# Altium schematic sheet Motor_Driver_Sheet3.SchDoc
size 420 x 297 mm; SheetNumber: 23; SheetTotal: 32
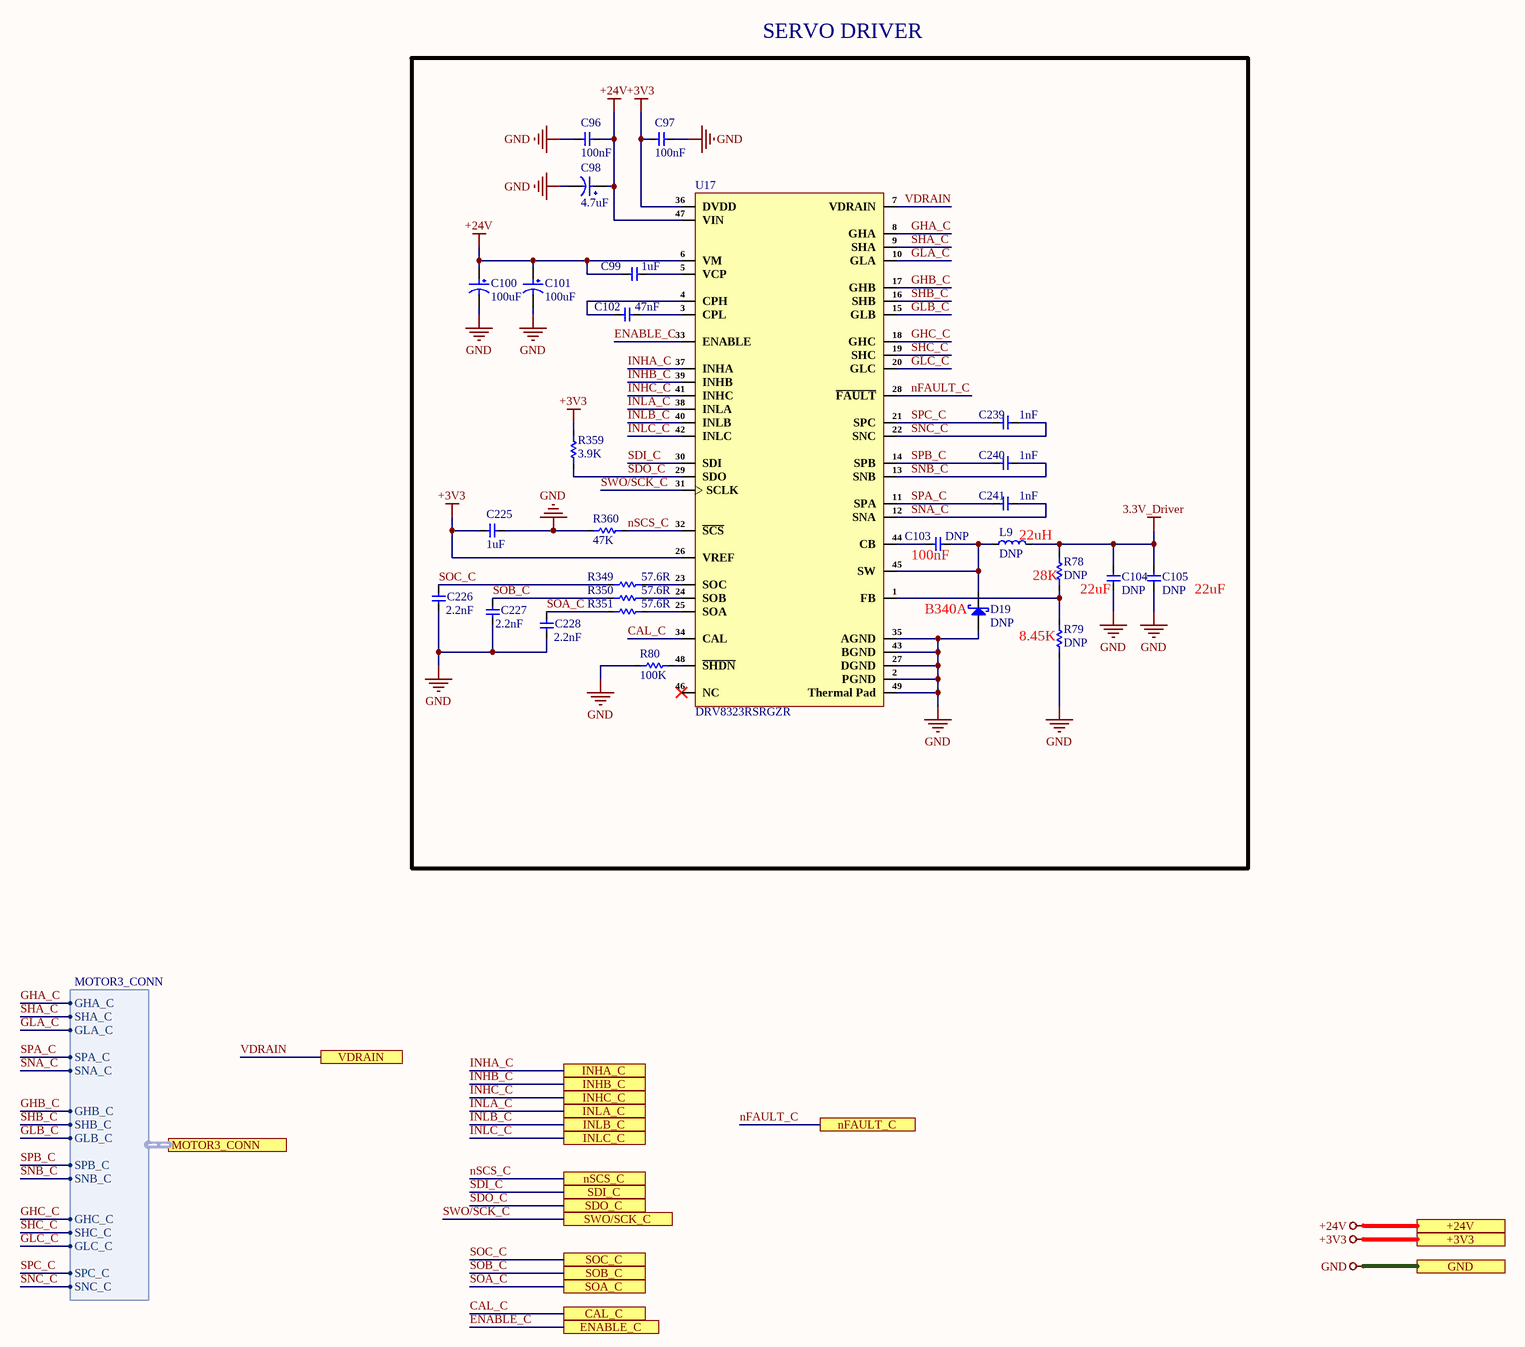
[diagram p0: Motor_Driver_Sheet3.SchDoc]

## Parts
C96  100nF  [cap-0402]
C97  100nF  [cap-0402]
C98  4.7uF  [VT1H4R7M0405]
C99  1uF  [Cap-0402]
C100  100uF  [RVT1A101M0605]
C101  100uF  [RVT1A101M0605]
C102  47nF  [Cap-0402]
C103  DNP  [cap-0402]
C104  DNP  [Cap-0805]
C105  DNP  [Cap-0805]
C225  1uF  [Cap-0402]
C226  2.2nF  [Cap-0603]
C227  2.2nF  [Cap-0603]
C228  2.2nF  [Cap-0603]
C239  1nF  [Cap-0402]
C240  1nF  [Cap-0402]
C241  1nF  [Cap-0402]
D19  DNP  [SMA(DO-214AC)]
L9  DNP  [SLF7045T- 220MR90-PF]
R78  DNP  [Res-0402]
R79  DNP  [Res-0402]
R80  100K  [Res-0402]
R349  57.6R  [Res-0402]
R350  57.6R  [Res-0402]
R351  57.6R  [Res-0402]
R359  3.9K  [Res-0402]
R360  47K  [Res-0402]
U17  DRV8323RSRGZR  [48-VQFN (7x7)]

## Ports
+3V3 (see Servo3[3A], CAN_Sheet[5D], Connector_Sheet[5D], Controller_Sheet[5D], Encoder_Sheet1[5D], Encoder_Sheet2[5D], Encoder_Sheet3[5D], Encoder_Sheet4[5D], EtherCAT_Sheet[5D], Motor_Driver_Sheet1[5D], Motor_Driver_Sheet2[5D], Motor_Driver_Sheet4[5D], Power_Sheet[5D], RJ45_Sheet[5D], RS485_RS232_Sheet[3D], Sec_Controller_Sheet1[5D], Sec_Controller_Sheet2[5D], Sec_Controller_Sheet3[5D], Sec_Controller_Sheet4[5D]), +24V (see Servo3[3A], Connector_Sheet[5D], DIO_1[5D], DIO_2[5D], DIO_3[5D], DIO_4[5D], MOSFET_Driver_Sheet1[5D], MOSFET_Driver_Sheet2[5D], MOSFET_Driver_Sheet3[5D], MOSFET_Driver_Sheet4[5D], Motor_Driver_Sheet1[5D], Motor_Driver_Sheet2[5D], Motor_Driver_Sheet4[5D], Power_Sheet[5D]), CAL_C (see Servo3[3B], Sec_Controller_Sheet3[2D]), ENABLE_C (see Servo3[3B], Sec_Controller_Sheet3[2D]), GND (see Servo3[3B], CAN_Sheet[5D], Connector_Sheet[5D], Controller_Sheet[5D], DIO_1[5D], DIO_2[5D], DIO_3[5D], DIO_4[5D], Encoder_Sheet1[5D], Encoder_Sheet2[5D], Encoder_Sheet3[5D], Encoder_Sheet4[5D], EtherCAT_Sheet[5D], MOSFET_Driver_Sheet1[5D], MOSFET_Driver_Sheet2[5D], MOSFET_Driver_Sheet3[5D], MOSFET_Driver_Sheet4[5D], Motor_Driver_Sheet1[5D], Motor_Driver_Sheet2[5D], Motor_Driver_Sheet4[5D], Power_Sheet[5D], RJ45_Sheet[5D], RS485_RS232_Sheet[3D], Sec_Controller_Sheet1[5D], Sec_Controller_Sheet2[5D], Sec_Controller_Sheet3[5D], Sec_Controller_Sheet4[5D]), INHA_C (see Servo3[3B], Sec_Controller_Sheet3[2D]), INHB_C (see Servo3[3B], Sec_Controller_Sheet3[2D]), INHC_C (see Servo3[3B], Sec_Controller_Sheet3[2D]), INLA_C (see Servo3[3B], Sec_Controller_Sheet3[2D]), INLB_C (see Servo3[3B], Sec_Controller_Sheet3[2D]), INLC_C (see Servo3[3B], Sec_Controller_Sheet3[2D]), MOTOR3_CONN (harness MOTOR3_CONN, see Servo3[4B], MOSFET_Driver_Sheet3[2D]), nFAULT_C (see Servo3[3B], Sec_Controller_Sheet3[3D]), nSCS_C (see Servo3[3B], Sec_Controller_Sheet3[2D]), SDI_C (see Servo3[3B], Sec_Controller_Sheet3[2D]), SDO_C (see Servo3[3B], Sec_Controller_Sheet3[2D]), SOA_C (see Servo3[3B], Sec_Controller_Sheet3[2D]), SOB_C (see Servo3[3B], Sec_Controller_Sheet3[2D]), SOC_C (see Servo3[3B], Sec_Controller_Sheet3[2D]), SWO/SCK_C (see Servo3[3B], Sec_Controller_Sheet3[2D]), VDRAIN (see Servo3[4B], MOSFET_Driver_Sheet1[2D], MOSFET_Driver_Sheet2[2D], MOSFET_Driver_Sheet3[2D], MOSFET_Driver_Sheet4[2D], Motor_Driver_Sheet1[2D], Motor_Driver_Sheet2[2D], Motor_Driver_Sheet4[2D])

## Harnesses
MOTOR3_CONN: GHA_C, SHA_C, GLA_C, SPA_C, SNA_C, GHB_C, SHB_C, GLB_C, SPB_C, SNB_C, GHC_C, SHC_C, GLC_C, SPC_C, SNC_C

## Nets
3.3V_Driver: C104.2 C105.2 L9.2 R78.2
+3V3: C97.2 C225.1 R359.2 U17.26(VREF) U17.36(DVDD) ; port +3V3
+24V: C96.1 C98.1 C99.2 C100.1 C101.1 U17.6(VM) U17.47(VIN) ; port +24V
GND: C96.2 C97.1 C98.2 C100.2 C101.2 C104.1 C105.1 C225.2 C226.1 C227.1 C228.1 D19.2(A) R79.1 R80.1 R360.1 U17.2(PGND) U17.27(DGND) U17.35(AGND) U17.43(BGND) U17.49(Thermal_Pad) ; port GND
CAL_C: U17.34(CAL) ; port CAL_C
ENABLE_C: U17.33(ENABLE) ; port ENABLE_C
GHA_C: U17.8(GHA) ; port MOTOR3_CONN.GHA_C
GHB_C: U17.17(GHB) ; port MOTOR3_CONN.GHB_C
GHC_C: U17.18(GHC) ; port MOTOR3_CONN.GHC_C
GLA_C: U17.10(GLA) ; port MOTOR3_CONN.GLA_C
GLB_C: U17.15(GLB) ; port MOTOR3_CONN.GLB_C
GLC_C: U17.20(GLC) ; port MOTOR3_CONN.GLC_C
INHA_C: U17.37(INHA) ; port INHA_C
INHB_C: U17.39(INHB) ; port INHB_C
INHC_C: U17.41(INHC) ; port INHC_C
INLA_C: U17.38(INLA) ; port INLA_C
INLB_C: U17.40(INLB) ; port INLB_C
INLC_C: U17.42(INLC) ; port INLC_C
nFAULT_C: U17.28(~{FAULT}) ; port nFAULT_C
nSCS_C: R360.2 U17.32(~{SCS}) ; port nSCS_C
SDI_C: U17.30(SDI) ; port SDI_C
SDO_C: R359.1 U17.29(SDO) ; port SDO_C
SHA_C: U17.9(SHA) ; port MOTOR3_CONN.SHA_C
SHB_C: U17.16(SHB) ; port MOTOR3_CONN.SHB_C
SHC_C: U17.19(SHC) ; port MOTOR3_CONN.SHC_C
SNA_C: C241.1 U17.12(SNA) ; port MOTOR3_CONN.SNA_C
SNB_C: C240.1 U17.13(SNB) ; port MOTOR3_CONN.SNB_C
SNC_C: C239.1 U17.22(SNC) ; port MOTOR3_CONN.SNC_C
SOA_C: C228.2 R351.1 ; port SOA_C
SOB_C: C227.2 R350.1 ; port SOB_C
SOC_C: C226.2 R349.1 ; port SOC_C
SPA_C: C241.2 U17.11(SPA) ; port MOTOR3_CONN.SPA_C
SPB_C: C240.2 U17.14(SPB) ; port MOTOR3_CONN.SPB_C
SPC_C: C239.2 U17.21(SPC) ; port MOTOR3_CONN.SPC_C
SWO/SCK_C: U17.31(SCLK) ; port SWO/SCK_C
VDRAIN: U17.7(VDRAIN) ; port VDRAIN
NetC99_1: C99.1 U17.5(VCP)
NetC102_1: C102.1 U17.4(CPH)
NetC102_2: C102.2 U17.3(CPL)
NetC103_1: C103.1 D19.1(K) L9.1 U17.45(SW)
NetC103_2: C103.2 U17.44(CB)
NetR78_1: R78.1 R79.2 U17.1(FB)
NetR80_2: R80.2 U17.48(~{SHDN})
NetR349_2: R349.2 U17.23(SOC)
NetR350_2: R350.2 U17.24(SOB)
NetR351_2: R351.2 U17.25(SOA)

Not connected (* = marked no-connect by the designer): U17 46(NC)*

## Notes on the sheet
- SERVO DRIVER
- (near L9) 22uH
- (near C103) 100nF
- (near D19) B340A
- (near R78) 28K
- (near C104) 22uF
- (near C105) 22uF
- (near R79) 8.45K
- File:
- Title:
- Date:
- Page
- Num:
- Total:
- Drawn By: Huzaifa Ali

## Library data of the parts
C96 C97 C103 = C1005X7R1H104KT000F: CAP CER 0.1UF 50V X7R 0402; Manufacturer: TDK; Tolerance: 10%; Voltage: 25V; Item Type: Capacitor; Supplier 1: Avnet; Manufacturer Part Number: C1005X7R1H104KT000F; RoHS: No; Category: Ceramic Capacitors; Dielectric: X7R; Supplier Part Number 1: C1005X7R1H104KT000F; LCSC Part Number: C361198; ComponentLink1Description: LCSC; ComponentLink1URL: https://www.lcsc.com/product-detail/Multilayer-Ceramic-Capacitors-MLCC-SMD-SMT_TDK-C1005X7R1H104KT000F_C361198.html
C98 = VT1H4R7M0405: 4.7uF 50V 14mA@120Hz ±20% SMD,D4xL5.4mm Aluminum Electrolytic Capacitors - SMD ROHS; Manufacturer: Roqang; Supplier: LCSC; LCSC Part Number: C213488; Manufacturer Part Number: VT1H4R7M0405; RoHS: No; Item Type: Capacitor
C99 C225 = CC0402KRX5R6BB105: CAP CER 1UF 10V X5R 0402; Manufacturer: Yageo; Tolerance: 10%; Dissipation Factor: 15%; Item Type: Capacitor; Supplier 1: Mouser; Manufacturer Part Number: CC0402KRX5R6BB105; RoHS: Yes; Category: Ceramic Capacitors; Stock 1: 6711367; Pricing 1: 1=0.11000, 10=0.05500, 50=0.05500, 100=0.03300, 500=0.02700, 1000=0.02200, 2500=0.02100, 10000=0.01800 (USD); Mount: Surface Mount; Case/Package: 0402; Number of Pins: 2; Case Code (Metric): 1005; Case Code (Imperial): 0402; Min Operating Temperature: -55°C; Max Operating Temperature: 85°C; Capacitance: 1uF; Dielectric: X5R; Package Quantity: 1; Voltage Rating: 10V; Packaging: Tape and Reel; Voltage Rating (DC): 10V; Termination: SMD/SMT; Resistor Type: Ceramic; Series: CC; Construction: Flat; Length: 1mm; Width: 0.02inch; Height: 0.5mm; Thickness: 0.022inch; Depth: 0.5mm; Radiation Hardening: No; REACH SVHC: No SVHC; Lead Free: Lead Free; Halogen Free: Halogen Free; RoHS Compliant: Yes; ComponentLink1URL: https://datasheet.ciiva.com/176/upy-gphc-x5r-4v-to-50v-12-176704.pdf?src-supplier=Digi-Key; ComponentLink1Description: https://datasheet.ciiva.com/176/upy-gphc-x5r-4v-to-50v-12-176704.pdf?src-supplier=Digi-Key; ComponentLink2URL: https://datasheet.ciiva.com/176/mlccorderingcode-176705.pdf?src-supplier=Digi-Key; ComponentLink2Description: https://datasheet.ciiva.com/176/mlccorderingcode-176705.pdf?src-supplier=Digi-Key; ComponentLink3URL: https://datasheet.ciiva.com/176/mlccorderingcode-176706.pdf?src-supplier=Digi-Key; ComponentLink3Description: https://datasheet.ciiva.com/176/mlccorderingcode-176706.pdf?src-supplier=Digi-Key; Supplier Part Number 1: 603-CC402KRX5R6BB105; LCSC Part Number: C106254
C100 C101 = RVT1A101M0605: 100uF 10V 55mA@120Hz ±20% SMD,D6.3xL5.4mm Aluminum Electrolytic Capacitors - SMD ROHS; Manufacturer: ROQANG; Manufacturer Part Number: RVT1A101M0605; Package: SMD,D6.3xL5.4mm; LCSC Part Number: C72474; Item Type: Capacitor; ComponentLink1Description: LCSC; ComponentLink1URL: https://www.lcsc.com/product-detail/Aluminum-Electrolytic-Capacitors-SMD_ROQANG-RVT1A101M0605_C72474.html
C102 = CC0402KRX7R9BB473: CAP CER 0.047UF 50V X7R 0402; Manufacturer: Yageo; Material: 4241ConductorMaterial; Tolerance: 10%; Temperature Coefficient: 30ppm/°C; Dielectric: 1511DielectricType; Item Type: Capacitor; Supplier: Future Electronics; Supplier Part Number: 2095687; Manufacturer Part Number: CC0402KRX7R9BB473; RoHS: Yes; Category: Ceramic Capacitors; Stock: 1130000; Pricing: 10000=0.0044, 40000=0.0042, 100000=0.004, 150000=0.0041, 250000=0.0039, 400000=0.0037, 500000=0.0038 (USD); Mounting Technology: Surface Mount; Case/Package: 0402; Case Code (Imperial): 0402; Case Code (Metric): 1005; Min Operating Temperature: -55°C; Max Operating Temperature: 125°C; Packaging: Tape and Reel; Value: 47nF; Voltage Rating: 50V; Series: CC; Voltage Rating (DC): 50V; Length: 0.039inch; Width: 0.02inch; Height: 550um; Thickness: 0.022inch; RoHS Compliant: Yes; Halogen Free: 5694HalogenFree; Lead Free: 5697LeadFree; ComponentLink1URL: https://datasheet.octopart.com/CC0402KRX7R9BB473-Yageo-datasheet-166511530.pdf?src-supplier=Future+Electronics; ComponentLink1Description: https://datasheet.octopart.com/CC0402KRX7R9BB473-Yageo-datasheet-166511530.pdf?src-supplier=Future+Electronics; ComponentLink2URL: http://www.yageo.com/documents/recent/UPY-GPHC_X7R_6.3V-to-50V_18.pdf?src-supplier=Digikey; ComponentLink2Description: http://www.yageo.com/documents/recent/UPY-GPHC_X7R_6.3V-to-50V_18.pdf?src-supplier=Digikey; ComponentLink3URL: https://datasheet.octopart.com/CC0402KRX7R9BB473-Yageo-datasheet-140260305.pdf?src-supplier=Newark; ComponentLink3Description: https://datasheet.octopart.com/CC0402KRX7R9BB473-Yageo-datasheet-140260305.pdf?src-supplier=Newark; LCSC Part Number: C272875
C104 C105 = GRM21BR61E226ME44L: CAP CER 22UF 25V X5R 0805; Manufacturer: Murata; Material: Ceramic; Tolerance: 20%; Item Type: Capacitor; Supplier 1: Arrow Electronics; Manufacturer Part Number: GRM21BR61E226ME44L; RoHS: Yes; Category: Ceramic Capacitors; Stock 1: 21193; Pricing 1: 1=0.45930, 10=0.35000, 25=0.33950, 50=0.26910, 100=0.22090, 250=0.21320, 500=0.16760, 1000=0.14640, 3000=0.11710, 6000=0.10550, 15000=0.10450 (USD); Mount: Surface Mount; Case/Package: 0805; Case Code (Metric): 2012; Case Code (Imperial): 0805; Weight: 0.000335oz; Min Operating Temperature: -55°C; Max Operating Temperature: 85°C; Capacitance: 22uF; Voltage Rating: 25V; Packaging: Tape and Reel; Dielectric: X5R; Voltage: 25V; Termination: SMD/SMT; Resistor Type: Ceramic; Voltage Rating (DC): 25V; Package Quantity: 3000; Series: GRM; Construction: Flat; Length: 2mm; Width: 1.25mm; Height: 1.25mm; Thickness: 0.057inch; Depth: 1.25mm; REACH SVHC: No SVHC; Lead Free: Lead Free; RoHS Compliant: Yes; ComponentLink1URL: https://datasheet.ciiva.com/22787/1747471-22787265.pdf?src-supplier=Farnell; ComponentLink1Description: https://datasheet.ciiva.com/22787/1747471-22787265.pdf?src-supplier=Farnell; ComponentLink2URL: https://datasheet.ciiva.com/7719/1747471-7719095.pdf?src-supplier=Element14; ComponentLink2Description: https://datasheet.ciiva.com/7719/1747471-7719095.pdf?src-supplier=Element14; ComponentLink3URL: https://datasheet.ciiva.com/28584/1747471-28584199.pdf?src-supplier=Element14; ComponentLink3Description: https://datasheet.ciiva.com/28584/1747471-28584199.pdf?src-supplier=Element14; Supplier Part Number 1: GRM21BR61E226ME44L; LCSC Part Number: C86816
C226-C228 = CC0603KRX7R9BB222: CAP CER 2200PF 50V X7R 0603; Manufacturer: Yageo; Tolerance: 10%; Insulation Resistance: 10GR; Dissipation Factor: 2.5%; Item Type: Capacitor; Supplier 1: RSComponents; Manufacturer Part Number: CC0603KRX7R9BB222; RoHS: Yes; Category: Ceramic Capacitors; Stock 1: 1; Pricing 1: 4000=0.00500 (USD); Mount: Surface Mount; Case/Package: 0603; Number of Pins: 2; Case Code (Metric): 1608; Case Code (Imperial): 0603; Min Operating Temperature: -55°C; Max Operating Temperature: 125°C; Capacitance: 2.2nF; Dielectric: X7R; Package Quantity: 1; Voltage Rating: 50V; Packaging: Tape and Reel; Voltage Rating (DC): 50V; Termination: SMD/SMT; Resistor Type: Ceramic; Voltage: 50V; Series: CC; Length: 1.6mm; Width: 0.031inch; Height: 0.8mm; Thickness: 0.035inch; Depth: 0.8mm; Radiation Hardening: No; REACH SVHC: No SVHC; Lead Free: Lead Free; Halogen Free: Halogen Free; RoHS Compliant: Yes; ComponentLink1URL: https://datasheet.ciiva.com/23768/1079489-23768004.pdf?src-supplier=Newark; ComponentLink1Description: https://datasheet.ciiva.com/23768/1079489-23768004.pdf?src-supplier=Newark; ComponentLink2URL: https://datasheet.ciiva.com/11788/0900766b8079c870-11788403.pdf?src-supplier=RSComponents; ComponentLink2Description: https://datasheet.ciiva.com/11788/0900766b8079c870-11788403.pdf?src-supplier=RSComponents; ComponentLink3URL: https://datasheet.ciiva.com/26862/getdatasheetpartid-403587-26862854.pdf?src-supplier=Verical; ComponentLink3Description: https://datasheet.ciiva.com/26862/getdatasheetpartid-403587-26862854.pdf?src-supplier=Verical; ComponentLink4URL: https://datasheet.ciiva.com/8033/70765-8033863.pdf?src-supplier=Element14; ComponentLink4Description: https://datasheet.ciiva.com/8033/70765-8033863.pdf?src-supplier=Element14; ComponentLink5URL: https://datasheet.ciiva.com/7978/1489800-7978172.pdf?src-supplier=Element14; ComponentLink5Description: https://datasheet.ciiva.com/7978/1489800-7978172.pdf?src-supplier=Element14; ComponentLink6URL: https://datasheet.ciiva.com/28450/1489800-28450632.pdf?src-supplier=Element14; ComponentLink6Description: https://datasheet.ciiva.com/28450/1489800-28450632.pdf?src-supplier=Element14; ComponentLink7URL: https://datasheet.ciiva.com/155/mlccorderingcode-155921.pdf?src-supplier=Digi-Key; ComponentLink7Description: https://datasheet.ciiva.com/155/mlccorderingcode-155921.pdf?src-supplier=Digi-Key; ComponentLink8URL: https://datasheet.ciiva.com/155/mlccorderingcode-155920.pdf?src-supplier=Digi-Key; ComponentLink8Description: https://datasheet.ciiva.com/155/mlccorderingcode-155920.pdf?src-supplier=Digi-Key; ComponentLink9URL: https://datasheet.ciiva.com/155/mlccorderingcode-155922.pdf?src-supplier=Digi-Key; ComponentLink9Description: https://datasheet.ciiva.com/155/mlccorderingcode-155922.pdf?src-supplier=Digi-Key; ComponentLink10URL: https://datasheet.ciiva.com/8033/1489800-8033864.pdf?src-supplier=Element14; ComponentLink10Description: https://datasheet.ciiva.com/8033/1489800-8033864.pdf?src-supplier=Element14; ComponentLink11URL: https://datasheet.ciiva.com/8033/1489800-8033862.pdf?src-supplier=Element14; ComponentLink11Description: https://datasheet.ciiva.com/8033/1489800-8033862.pdf?src-supplier=Element14; ComponentLink12URL: https://datasheet.ciiva.com/16625/upy-gphc-x7r-6-3v-to-50v-8-16625531.pdf?src-supplier=Avnet+Europe; ComponentLink12Description: https://datasheet.ciiva.com/16625/upy-gphc-x7r-6-3v-to-50v-8-16625531.pdf?src-supplier=Avnet+Europe; Supplier Part Number 1: 6169509; LCSC Part Number: C107082
C239-C241 = C1005C0G1E102JT000F: CAP CER 1000PF 25V C0G 0402; Manufacturer: TDK; Item Type: Capacitor; ComponentLink1Description: LCSC; ComponentLink1URL: https://www.lcsc.com/product-detail/Multilayer-Ceramic-Capacitors-MLCC-SMD-SMT_TDK-C1005C0G1E102JT000F_C343059.html; Manufacturer Part Number: C1005C0G1E102JT000F; Package: 0402; LCSC Part Number: C343059
D19 = B340A: 40V 3A 550mV@3A SMA(DO-214AC) Schottky Barrier Diodes (SBD) ROHS; Manufacturer: FUXINSEMI; Item Type: Diode; Manufacturer Part Number: B340A; Package: SMA(DO-214AC); LCSC Part Number: C3018525; ComponentLink1Description: LCSC; ComponentLink1URL: https://www.lcsc.com/product-detail/Schottky-Barrier-Diodes-SBD_FUXINSEMI-B340A_C3018525.html
L9 = SLF7045T-220MR90-PF: FIXED IND 22UH 1.34A 73.2MOHM SM; Manufacturer: TDK; Core Material: Ferrite; Tolerance: 20%; Saturation Current: 900mA; Shielding: Shielded; DC Resistance (DCR): 61mR; Test Frequency: 100kHz; Item Type: Inductor; Supplier 1: RSComponents; Manufacturer Part Number: SLF7045T-220MR90-PF; RoHS: Yes; Category: Fixed Inductors; Stock 1: 650; Pricing 1: 10=0.64900, 100=0.61900, 500=0.49700, 1000=0.34500, 2500=0.32500 (GBP); Mount: Surface Mount; Case/Package: Nonstandard; Min Operating Temperature: -40°C; Max Operating Temperature: 85°C; Packaging: Tape and Reel; Inductance Tolerance: 20%; Package Quantity: 1; Current Rating: 1.34A; Resistor Type: Wirewound; Inductance: 22uH; Max DC Current: 900mA; Termination: SMD/SMT; RMS Current (Irms): 1.34A; DC Current: 1.34A; Series: SLF; Rated Current-Max: 900mA; Length: 0.276inch; Width: 0.276inch; Height: 4.5mm; Height - Seated (Max): 0.189inch; Depth: 7.2mm; Radiation Hardening: No; Reach SVHC Compliant: Yes; Military Standard: Not; Lead Free: Lead Free; RoHS Compliant: Yes; ComponentLink1URL: https://datasheet.ciiva.com/3866/84print-detail-pdf-phplangenpart-noslf7045t-220mr90-pfnreimp-unit-x-3866590.pdf?src-supplier=Arrow+Electronics; ComponentLink1Description: https://datasheet.ciiva.com/3866/84print-detail-pdf-phplangenpart-noslf7045t-220mr90-pfnreimp-unit-x-3866590.pdf?src-supplier=Arrow+Electronics; LCSC Part Number: C13754; Supplier Part Number 1: 9164248
R78 = RT0402BRD0728KL: RES SMD 28K OHM 0.1% 1/16W 0402; Manufacturer: Yageo; Item Type: Resistor; Supplier: Digi-Key; Supplier Part Number: YAG4224CT-ND; Manufacturer Part Number: RT0402BRD0728KL; RoHS: Yes; Category: Chip SMD Resistors; Stock: 21647; Pricing: 1=0.38, 10=0.307, 50=0.1704, 100=0.1198, 500=0.07636, 1000=0.05287, 5000=0.04406 (USD); ComponentLink1URL: https://datasheet.ciiva.com/2582/pyu-rt-1-to-0-05-rohs-l-5-2582274.pdf?src-supplier=Digi-Key; ComponentLink1Description: https://datasheet.ciiva.com/2582/pyu-rt-1-to-0-05-rohs-l-5-2582274.pdf?src-supplier=Digi-Key; LCSC Part Number: C852686
R79 = 0402WGF8451TCE: 62.5mW Thick Film Resistors 50V ±100ppm/℃ ±1% 8.45kΩ 0402 Chip Resistor - Surface Mount ROHS; Manufacturer: Royal Electronic Factory; Supplier: Mouser; LCSC Part Number: C270579; Manufacturer Part Number: 0402WGF8451TCE; RoHS: No; Item Type: Resistor; Pricing: 10000=0.004 (USD)
R80 = RT0402BRD07100KL: RES SMD 100K OHM 0.1% 1/16W 0402; Manufacturer: Yageo; Voltage Rating (DC): 50V; Item Type: Resistor; Supplier: Digikey; Supplier Part Number: YAG1343CT-ND; Manufacturer Part Number: RT0402BRD07100KL; RoHS: Yes; Category: Chip SMD Resistors; Stock: 62932; Pricing: 1=0.16, 10=0.121, 50=0.0958, 100=0.0859, 500=0.0654, 1000=0.0578, 5000=0.04283 (USD); ComponentLink1URL: https://datasheet.ciiva.com/12724/pyu-rt-1-to-0-05-rohs-l-4-12724954.pdf?src-supplier=Mouser; ComponentLink1Description: https://datasheet.ciiva.com/12724/pyu-rt-1-to-0-05-rohs-l-4-12724954.pdf?src-supplier=Mouser; LCSC Part Number: C852472
R349-R351 = ERJ-2RKF57R6X: RES SMD 57.6 OHM 1% 1/10W 0402; Manufacturer: Panasonic; Item Type: Resistors; Supplier: Mouser; Supplier Part Number: 667-ERJ-2RKF57R6X; Manufacturer Part Number: ERJ-2RKF57R6X; RoHS: Yes; Stock: 32931; Pricing: 1=0.1, 10=0.015, 50=0.015, 100=0.009, 1000=0.006, 10000=0.003 (USD); ComponentLink1URL: https://datasheet.ciiva.com/9188/aoa0000ce2-9188571.pdf?src-supplier=Avnet; ComponentLink1Description: https://datasheet.ciiva.com/9188/aoa0000ce2-9188571.pdf?src-supplier=Avnet; ComponentLink2URL: https://datasheet.ciiva.com/9188/aoa0000ce2-9188574.pdf?src-supplier=Avnet; ComponentLink2Description: https://datasheet.ciiva.com/9188/aoa0000ce2-9188574.pdf?src-supplier=Avnet; ComponentLink3URL: https://datasheet.ciiva.com/24026/aoa0000ce2-24026248.pdf?src-supplier=Mouser; ComponentLink3Description: https://datasheet.ciiva.com/24026/aoa0000ce2-24026248.pdf?src-supplier=Mouser; ComponentLink4URL: https://datasheet.ciiva.com/43467/1678782-43467198.pdf?src-supplier=Farnell; ComponentLink4Description: https://datasheet.ciiva.com/43467/1678782-43467198.pdf?src-supplier=Farnell; ComponentLink5URL: https://datasheet.ciiva.com/46372/1678782-46372935.pdf?src-supplier=Element14; ComponentLink5Description: https://datasheet.ciiva.com/46372/1678782-46372935.pdf?src-supplier=Element14; ComponentLink6URL: https://datasheet.ciiva.com/46372/1678782-46372936.pdf?src-supplier=Element14; ComponentLink6Description: https://datasheet.ciiva.com/46372/1678782-46372936.pdf?src-supplier=Element14; ComponentLink7URL: https://datasheet.ciiva.com/22668/1678782-22668391.pdf?src-supplier=Element14; ComponentLink7Description: https://datasheet.ciiva.com/22668/1678782-22668391.pdf?src-supplier=Element14; ComponentLink8URL: https://datasheet.ciiva.com/22743/1678782-22743894.pdf?src-supplier=Element14; ComponentLink8Description: https://datasheet.ciiva.com/22743/1678782-22743894.pdf?src-supplier=Element14; ComponentLink9URL: https://datasheet.ciiva.com/30107/aoa0000ce2-30107676.pdf?src-supplier=Onlinecomponents.com; ComponentLink9Description: https://datasheet.ciiva.com/30107/aoa0000ce2-30107676.pdf?src-supplier=Onlinecomponents.com; LCSC Part Number: C3025671
R359 = RC0402FR-073K9L: RES 3.9K OHM 1% 1/16W 0402; Manufacturer: Yageo; Temperature Coefficient: 100ppm/°C; Power Rating: 62.5mW; Value: 3.9kR; Voltage Rating: 50V; Max Power Dissipation: 63mW; Item Type: Resistor; Supplier: Future Electronics; Supplier Part Number: 9808155; Manufacturer Part Number: RC0402FR-073K9L; RoHS: Yes; Category: Chip SMD Resistors; Stock: 6910000; Pricing: 10000=0.0011, 100000=0.0011, 300000=0.001, 750000=0.001, 2000000=0.0009 (USD); Case/Package: 0402; Case Code (Imperial): 0402; Case Code (Metric): 1005; Min Operating Temperature: -55°C; Max Operating Temperature: 155°C; Tolerance: 1%; Packaging: Tape and Reel; Resistor Type: Thick Film; Series: RC; Termination: SMD/SMT; Number of Terminations: 2; Features: Moisture Resistant; Resistance Tolerance: 1%; Construction: Rectangular; Voltage Rating (AC): 50V; Length: 1mm; Depth: 0.5mm; Lead Free: Lead Free; RoHS Compliant: Yes; Reach SVHC Compliant: Unknown; Military Standard: Not; ComponentLink1URL: https://datasheet.ciiva.com/12666/pyu-rc0402-51-rohs-l-6-r-12666997.pdf?src-supplier=Mouser; ComponentLink1Description: https://datasheet.ciiva.com/12666/pyu-rc0402-51-rohs-l-6-r-12666997.pdf?src-supplier=Mouser; ComponentLink2URL: https://datasheet.ciiva.com/7849/1018594-7849989.pdf?src-supplier=Element14; ComponentLink2Description: https://datasheet.ciiva.com/7849/1018594-7849989.pdf?src-supplier=Element14; ComponentLink3URL: https://datasheet.ciiva.com/7849/1018594-7849990.pdf?src-supplier=Element14; ComponentLink3Description: https://datasheet.ciiva.com/7849/1018594-7849990.pdf?src-supplier=Element14; ComponentLink4URL: https://datasheet.ciiva.com/15189/getdatasheetpartid-469246-15189453.pdf?src-supplier=Verical; ComponentLink4Description: https://datasheet.ciiva.com/15189/getdatasheetpartid-469246-15189453.pdf?src-supplier=Verical; LCSC Part Number: C131467
R360 = RC0402FR-0747KL: RES 47K OHM 1% 1/16W 0402; Manufacturer: Yageo; Power Rating: 62.5mW; Temperature Coefficient: 100ppm/°C; Voltage Rating: 50V; Resistance: 47kR; Max Power Dissipation: 63mW; Item Type: Resistor; Supplier 1: Avnet; Manufacturer Part Number: RC0402FR-0747KL; RoHS: Yes; Category: Chip SMD Resistors; Stock 1: 680000; Pricing 1: 10000=0.00085, 20000=0.00087, 40000=0.00084, 60000=0.00083, 80000=0.00079, 100000=0.00078, 1000000=0.00076 (USD); Case/Package: 0402; Case Code (Imperial): 0402; Case Code (Metric): 1005; Size Code: 0402; Min Operating Temperature: -55°C; Max Operating Temperature: 155°C; Tolerance: 1%; Series: RC; Packaging: Tape and Reel; Package Quantity: 1; Termination: SMD/SMT; Resistor Type: Thick Film; Number of Terminations: 2; Features: Moisture Resistant; Resistance Tolerance: 1%; Construction: Rectangular; Length: 1mm; Width: 0.02inch; Height: 0.016inch; Depth: 0.5mm; RoHS Compliant: Yes; Military Standard: Not; Lead Free: Lead Free; ComponentLink1URL: https://datasheet.ciiva.com/46412/1018594-46412839.pdf?src-supplier=Element14; ComponentLink1Description: https://datasheet.ciiva.com/46412/1018594-46412839.pdf?src-supplier=Element14; ComponentLink2URL: https://datasheet.ciiva.com/2453/pyu-r-int-thick-7-2453389.pdf?src-supplier=Digi-Key; ComponentLink2Description: https://datasheet.ciiva.com/2453/pyu-r-int-thick-7-2453389.pdf?src-supplier=Digi-Key; ComponentLink3URL: https://datasheet.ciiva.com/2453/pyu-r-int-thick-7-2453390.pdf?src-supplier=Digi-Key; ComponentLink3Description: https://datasheet.ciiva.com/2453/pyu-r-int-thick-7-2453390.pdf?src-supplier=Digi-Key; ComponentLink4URL: https://datasheet.ciiva.com/2453/pyu-r-int-thick-7-2453388.pdf?src-supplier=Digi-Key; ComponentLink4Description: https://datasheet.ciiva.com/2453/pyu-r-int-thick-7-2453388.pdf?src-supplier=Digi-Key; ComponentLink5URL: https://datasheet.ciiva.com/15189/getdatasheetpartid-323748-15189466.pdf?src-supplier=Verical; ComponentLink5Description: https://datasheet.ciiva.com/15189/getdatasheetpartid-323748-15189466.pdf?src-supplier=Verical; ComponentLink6URL: https://datasheet.ciiva.com/16793/pyu-rc0402-51-rohs-l-6-r-16793430.pdf?src-supplier=Future+Electronics; ComponentLink6Description: https://datasheet.ciiva.com/16793/pyu-rc0402-51-rohs-l-6-r-16793430.pdf?src-supplier=Future+Electronics; Supplier Part Number 1: RC0402FR-0747KL; LCSC Part Number: C93943
U17 = DRV8323RSRGZR: IC MTR DRV MULTIPHAS 6-60V 48QFN; Manufacturer: Texas Instruments; Supplier: Digikey; Supplier Part Number: 296-47769-1-ND; Manufacturer Part Number: DRV8323RSRGZR; RoHS: Yes; Item Type: IC; Stock: 39326; Pricing: 1=5.19, 10=4.659, 25=4.404, 100=3.8169, 250=3.62116, 500=3.24926, 1000=2.74033 (USD); ComponentLink1URL: http://www.ti.com/general/docs/suppproductinfo.tsp?distId=10&amp;gotoUrl=http%3A%2F%2Fwww.ti.com%2Flit%2Fgpn%2Fdrv8323r&src-supplier=Digikey; ComponentLink1Description: http://www.ti.com/general/docs/suppproductinfo.tsp?distId=10&amp;gotoUrl=http%3A%2F%2Fwww.ti.com%2Flit%2Fgpn%2Fdrv8323r&src-supplier=Digikey; ComponentLink2URL: http://www.ti.com/lit/ds/symlink/drv8323r.pdf?src-supplier=Digikey; ComponentLink2Description: http://www.ti.com/lit/ds/symlink/drv8323r.pdf?src-supplier=Digikey